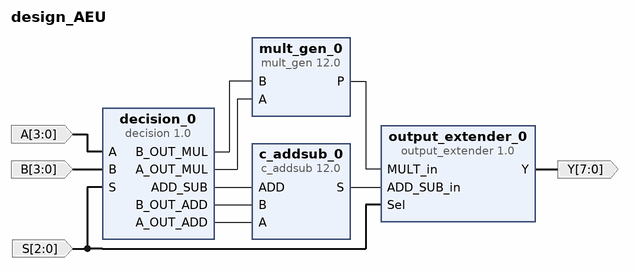
[diagram p0: block diagram of the top level]
# Vivado block design design_AEU, Vivado 2015.1
create_bd_design design_AEU

create_bd_port -dir I -from 2 -to 0 S
create_bd_port -dir I -from 3 -to 0 A
create_bd_port -dir I -from 3 -to 0 B
create_bd_port -dir O -from 7 -to 0 Y

create_bd_cell -type ip -vlnv xilinx.com:ip:c_addsub:12.0 c_addsub_0
set_property -dict [list \
  CONFIG.A_Type Signed \
  CONFIG.B_Type Signed \
  CONFIG.A_Width 4 \
  CONFIG.B_Width 4 \
  CONFIG.Add_Mode Add_Subtract \
  CONFIG.Out_Width 4 \
  CONFIG.Latency_Configuration Automatic \
  CONFIG.Latency 1 \
  CONFIG.B_Value 0000 \
  CONFIG.CE false \
  CONFIG.SCLR false \
  CONFIG.SSET false \
] [get_bd_cells c_addsub_0]
create_bd_cell -type ip -vlnv xilinx.com:ip:mult_gen:12.0 mult_gen_0
set_property -dict [list \
  CONFIG.PortAType Signed \
  CONFIG.PortAWidth 4 \
  CONFIG.PortBType Signed \
  CONFIG.PortBWidth 4 \
  CONFIG.Multiplier_Construction Use_Mults \
  CONFIG.ClockEnable false \
  CONFIG.SyncClear false \
] [get_bd_cells mult_gen_0]
create_bd_cell -type ip -vlnv xilinx.com:user:decision:1.0 decision_0
create_bd_cell -type ip -vlnv xilinx.com:user:output_extender:1.0 output_extender_0

# ---- connections ----

connect_bd_net [get_bd_pins decision_0/ADD_SUB] [get_bd_pins c_addsub_0/ADD]
connect_bd_net [get_bd_pins decision_0/B_OUT_MUL] [get_bd_pins mult_gen_0/B]
connect_bd_net [get_bd_pins decision_0/A_OUT_MUL] [get_bd_pins mult_gen_0/A]
connect_bd_net [get_bd_pins decision_0/B_OUT_ADD] [get_bd_pins c_addsub_0/B]
connect_bd_net [get_bd_pins decision_0/A_OUT_ADD] [get_bd_pins c_addsub_0/A]
connect_bd_net [get_bd_ports S] [get_bd_pins decision_0/S] [get_bd_pins output_extender_0/Sel]
connect_bd_net [get_bd_ports A] [get_bd_pins decision_0/A]
connect_bd_net [get_bd_ports B] [get_bd_pins decision_0/B]
connect_bd_net [get_bd_pins c_addsub_0/S] [get_bd_pins output_extender_0/ADD_SUB_in]
connect_bd_net [get_bd_pins mult_gen_0/P] [get_bd_pins output_extender_0/MULT_in]
connect_bd_net [get_bd_pins output_extender_0/Y] [get_bd_ports Y]

validate_bd_design
save_bd_design
